# Altium project ExtruderZProbe.PrjPcb
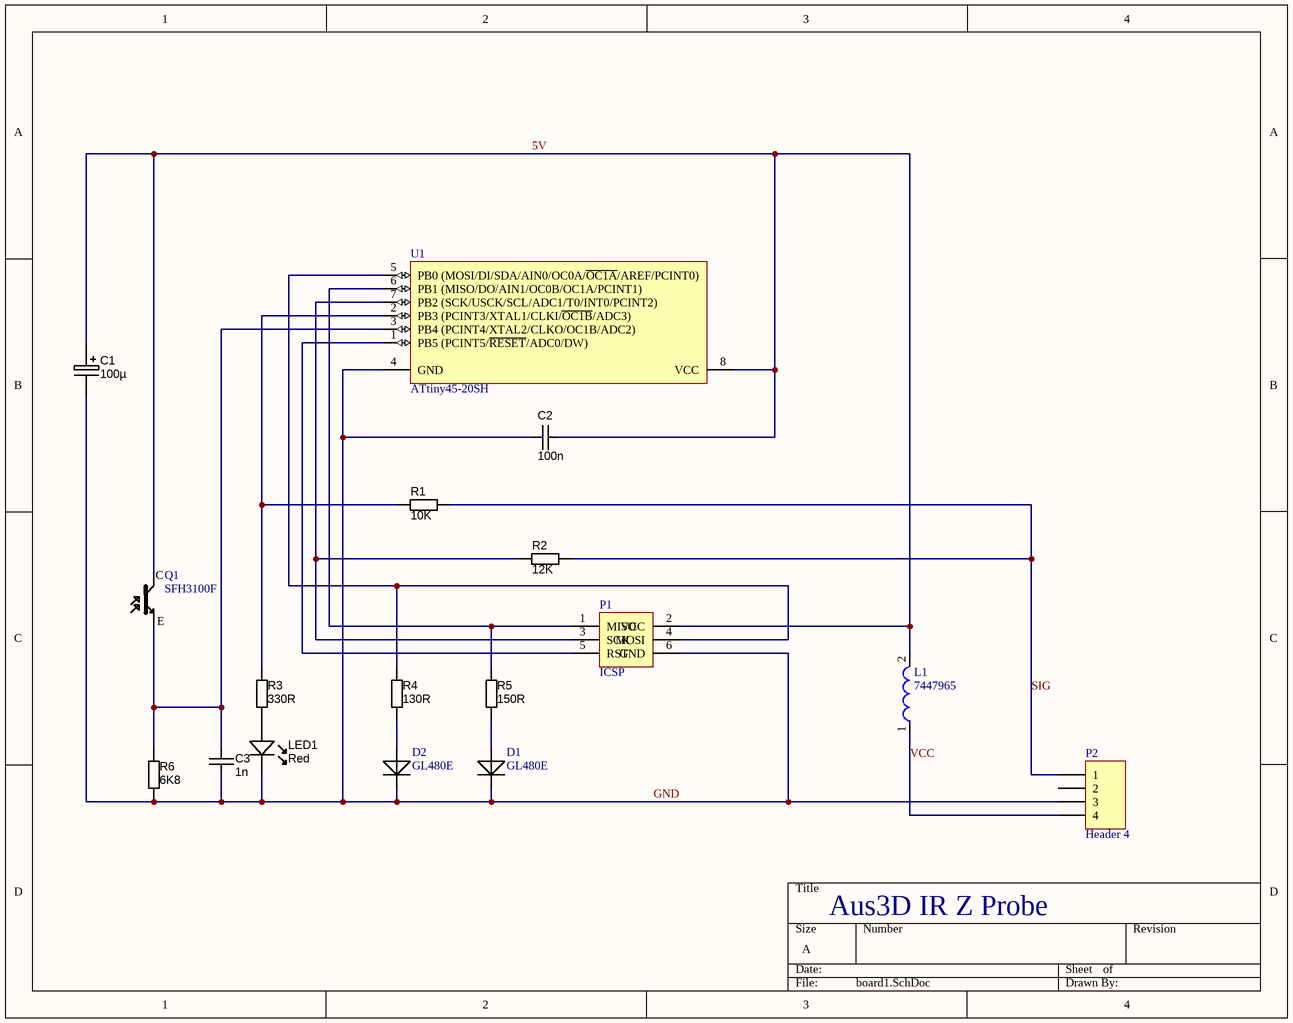
[diagram p0: board1.SchDoc]
1 sheet, 17 parts. Net scope: global (net labels, ports and power ports of the same name join across sheets).
Board files: PCB4.PcbDoc, PCB3.PcbDoc

## Sheet board1.SchDoc
size A

### Parts
C1  100µ  [6.3-DIA-CAP]
C2  100n  [CAPC1005X55N]
C3  1n  [CAPC1005X55N]
D1  GL480E  [LED-2.54spacing]
D2  GL480E  [LED-2.54spacing]
L1  7447965  [SMD-0603]
LED1  Red  [LED-0603-RED]
P1  ICSP  [HDR2X3]
P2  Header 4  [JST-4P]
Q1  SFH3100F  [SFH3100F-footprint]
R1  value 10K  [RESC1608X55N]  (hidden comment: Thick Film)
R2  value 12K  [RESC1608X55N]  (hidden comment: Thick Film)
R3  value 330R  [RESC1608X55N]  (hidden comment: Thick Film)
R4  value 130R  [RESC1608X55N]  (hidden comment: Thick Film)
R5  value 150R  [RESC1608X55N]  (hidden comment: Thick Film)
R6  value 6K8  [RESC1608X55N]  (hidden comment: Thick Film)
U1  ATtiny45-20SH  [8S2_N]

### Nets
5V: C1.1 C2.2 L1.2 P1.2(VCC) Q1.1 U1.8(VCC)
GND: C1.2 C2.1 C3.2 D1.1 D2.1 LED1.K P1.6(GND) P2.3 R6.1 U1.4(GND)
SIG: P2.1 R1.1 R2.1
VCC: L1.1 P2.4
NetC3_1: C3.1 Q1.2 R6.2 U1.3(PB4_(PCINT4/XTAL2/CLKO/OC1B/ADC2))
NetD1_2: D1.2 R5.1
NetD2_2: D2.2 R4.1
NetLED1_A: LED1.A R3.2
NetP1_1: P1.1(MISO) R5.2 U1.6(PB1_(MISO/DO/AIN1/OC0B/OC1A/PCINT1))
NetP1_3: P1.3(SCK) R2.2 U1.7(PB2_(SCK/USCK/SCL/ADC1/T0/INT0/PCINT2))
NetP1_4: P1.4(MOSI) R4.2 U1.5(PB0_(MOSI/DI/SDA/AIN0/OC0A/~{OC1A}/AREF/PCINT0))
NetP1_5: P1.5(RST) U1.1(PB5_(PCINT5/~{RESET}/ADC0/DW))
NetR1_2: R1.2 R3.1 U1.2(PB3_(PCINT3/XTAL1/CLKI/~{OC1B}/ADC3))

Not connected (* = marked no-connect by the designer): P2 2

### Notes on the sheet
- Aus3D IR Z Probe
- (in symbol SFH3100F) C; E

### Library data of the parts
C1 = CAPE_100u_16V_THD: Capacitor THD Electrolytic 100uF 20% 16V Radial; Manufacturer: Panasonic - ECG; Manufacturer Part Number: ECA-1CM101; Material: Aluminum Electrolytic; SCDType: spec; Package / Case: Radial - Through hole; Ratings: 16V; Tolerance: ±20%; Supplier 1: Digi-Key; Supplier Part Number 1: P5138-ND; Value: 100µ; Supplier: http://au.rs-online.com/web/p/aluminium-capacitors/4490968/
C2 = CAPC_100n_0402_X5R_16V_10%: Capacitor SMD Cer 100nF 10% 16V X5R 0402; Manufacturer 1: AVX Corporation; Manufacturer Part Number 1: 0402YD104KAT2A; Ratings: 16V; X5R; SCDType: spec; Tolerance: ±10%; Operating Temperature: -55°C ~ 125°C; Package / Case: 0402 (1005 Metric); Size / Dimension: 0.039" L x 0.020" W (1.00mm x 0.50mm); Supplier 1: Digi-Key; Supplier Part Number 1: 478-1126-1-ND; ComponentLink1URL: http://www.avx.com/docs/Catalogs/cx5r.pdf; ComponentLink1Description: http://www.avx.com/docs/Catalogs/cx5r.pdf; Supplier 2: Digi-Key; Supplier Part Number 2: 311-1347-1-ND; Manufacturer 2: Yageo; Manufacturer Part Number 2: CC0402KRX5R7BB104; ComponentLink2URL: http://www.yageo.com/documents/recent/UPY-GPHC_X5R_4V-to-50V_12.pdf; ComponentLink2Description: http://www.yageo.com/documents/recent/UPY-GPHC_X5R_4V-to-50V_12.pdf; Value: 100n; Supplier: http://au.rs-online.com/web/p/ceramic-multilayer-capacitors/6983197/
C3 = CAPC_1n_0402_X7R_16V_10%: Capacitor SMD Cer 1nF 10% 16V X7R 0402; Manufacturer 1: AVX Corporation; Manufacturer Part Number 1: 0402YC102KAT2A; Ratings: 16V; X7R; SCDType: spec; Tolerance: ±10%; Operating Temperature: -55°C ~ 125°C; Package / Case: 0402 (1005 Metric); Size / Dimension: 0.039" L x 0.020" W (1.00mm x 0.50mm); Manufacturer 2: Yageo; Manufacturer Part Number 2: CC0402KRX7R7BB102; Supplier 1: Digi-Key; Supplier Part Number 1: 478-6197-1-ND; ComponentLink1URL: http://www.avx.com/docs/Catalogs/cx7r.pdf; ComponentLink1Description: http://www.avx.com/docs/Catalogs/cx7r.pdf; Supplier 2: Digi-Key; Supplier Part Number 2: 311-1352-1-ND; ComponentLink2URL: http://www.yageo.com/documents/recent/UPY-GPHC_X7R_6.3V-to-50V_8.pdf; ComponentLink2Description: http://www.yageo.com/documents/recent/UPY-GPHC_X7R_6.3V-to-50V_8.pdf; Value: 1n; Supplier: http://au.rs-online.com/web/p/ceramic-multilayer-capacitors/6983178/
L1 = 7447965: SMD-Multilayer Inductor WE-MI, L = 1.00 µH; Inductance: 1.00 µH; DatasheetVersion: ver 5, Oct-2004; PackageVersion: 2009; PackageReference: SMD-0603; PackageDescription: Chip Inductor, 2-Leads, Body 1.6 x 0.8 mm; ComponentLink1Description: Manufacturer URL; ComponentLink1URL: http://www.we-online.com; ComponentLink2Description: Datasheet; ComponentLink2URL: http://www.we-online.de/katalog/media/pdf/7447965.pdf; Supplier: https://au.rs-online.com/web/p/multilayer-surface-mount-inductors/6041473/
LED1 = LED_SMD_Red_0603_220mcd: LED 0603 SMD Hyper Red 630nm 220mcd 20mA; Manufacturer 1: Kingbright Company LLC; Manufacturer Part Number 1: APT1608SURCK; Material: AlGaInP on GaAs; Ratings: 220 mcd; 630 nm; Voltage - Forward (Vf) Typ: 1.95V; Voltage - Forward (Vf) @ 10mA: 1.9V; SCDType: source; Package / Case: 0603 (1608 metric); Supplier 1: Digi-Key; Supplier Part Number 1: 754-1123-1-ND; ComponentLink1URL: http://www.us.kingbright.com/images/catalog/SPEC/APT1608SURCK.pdf; ComponentLink1Description: http://www.us.kingbright.com/images/catalog/SPEC/APT1608SURCK.pdf
P1 = Header 3X2: Header, 3-Pin, Dual row; LatestRevisionDate: 17-Jul-2002; LatestRevisionNote: Re-released for DXP Platform.; Publisher: Altium Limited
P2 = Header 4: Header, 4-Pin; LatestRevisionDate: 17-Jul-2002; LatestRevisionNote: Re-released for DXP Platform.; Publisher: Altium Limited; Supplier: http://au.rs-online.com/web/p/pcb-headers/8201551/
Q1 = SFH3100F: GL480E; Supplier: http://au.rs-online.com/web/p/phototransistors/6548738/
R1 R2 R4-R6 = RES_2K2_0603_5%: Resistor SMD chip 2.2k Ohm 0.1W 5% 0603; Manufacturer 1: Yageo; Manufacturer Part Number 1: RC0603JR-072K2L; Ratings: 1/10 W; SCDType: spec; Temperature Coefficient: ±100ppm/°C; Package / Case: 0603 (1608 metric); Tolerance: ±5%; Material: Thick Film; Supplier 1: Digi-Key; Supplier Part Number 1: 311-2.2KGRDKR-ND; RoHS 1: RoHS Compliant; ComponentLink1URL: http://www.yageo.com/documents/recent/PYu-RC0603_51_RoHS_L_4.pdf; ComponentLink1Description: http://www.yageo.com/documents/recent/PYu-RC0603_51_RoHS_L_4.pdf; Supplier 2: Digi-Key; Supplier Part Number 2: 1276-5070-6-ND; Manufacturer 2: Samsung Electro-Mechanics America, Inc; Manufacturer Part Number 2: RC1608J222CS; RoHS 2: RoHS Compliant; ComponentLink2URL: http://www.samsungsem.com/servlet/FileDownload?filename=productcatalog/pdf/Chip_Resistor.pdf; ComponentLink2Description: http://www.samsungsem.com/servlet/FileDownload?filename=productcatalog/pdf/Chip_Resistor.pdf; Supplier 3: Digi-Key; Supplier Part Number 3: RMCF0603JT2K20DKR-ND; Manufacturer 3: Stackpole Electronics Inc; Manufacturer Part Number 3: RMCF0603JT2K20; RoHS 3: RoHS Compliant; ComponentLink3URL: http://www.seielect.com/Catalog/SEI-RMCF_RMCP.pdf; ComponentLink3Description: http://www.seielect.com/Catalog/SEI-RMCF_RMCP.pdf; Supplier 4: Digi-Key; Supplier Part Number 4: RHM2.2KCGDKR-ND; Manufacturer 4: Rohm Semiconductor; Manufacturer Part Number 4: MCR03ERTJ222; RoHS 4: RoHS Compliant; ComponentLink4URL: http://rohmfs.rohm.com/en/products/databook/datasheet/passive/resistor/chip_resistor/mcr_g.pdf; ComponentLink4Description: http://rohmfs.rohm.com/en/products/databook/datasheet/passive/resistor/chip_resistor/mcr_g.pdf; Supplier 5: Digi-Key; Supplier Part Number 5: P2.2KGDKR-ND; Manufacturer 5: Panasonic Electronic Components; Manufacturer Part Number 5: ERJ-3GEYJ222V; RoHS 5: RoHS Compliant; ComponentLink5URL: http://industrial.panasonic.com/www-cgi/jvcr13pz.cgi?E+PZ+3+AOA0001+ERJ3GEYJ222V+7+WW; ComponentLink5Description: http://industrial.panasonic.com/www-cgi/jvcr13pz.cgi?E+PZ+3+AOA0001+ERJ3GEYJ222V+7+WW
  R1: Supplier: http://au.rs-online.com/web/p/surface-mount-fixed-resistors/6789667/
  R2: Supplier: http://au.rs-online.com/web/p/surface-mount-fixed-resistors/7088745/
  R4: Supplier: http://au.rs-online.com/web/p/surface-mount-fixed-resistors/8102129/
  R5: Supplier: http://au.rs-online.com/web/p/surface-mount-fixed-resistors/6789784/
  R6: Supplier: http://au.rs-online.com/web/p/surface-mount-fixed-resistors/8102303/
R3 = RES_330R_0603_5%: Resistor SMD chip 330 Ohm 0.1W 5% 0603; Manufacturer 1: Vishay Dale; Manufacturer Part Number 1: CRCW0603330RJNEA; Ratings: 1/10 W; SCDType: spec; Manufacturer 2: Yageo; Manufacturer Part Number 2: RC0603JR-07330RL; Package / Case: 0603 (1608 metric); Tolerance: ±5%; Material: Thick Film; Supplier 1: Digi-Key; Supplier Part Number 1: 541-330GCT-ND; ComponentLink1URL: http://www.vishay.com/doc?20035; ComponentLink1Description: http://www.vishay.com/doc?20035; Supplier 2: Digi-Key; Supplier Part Number 2: 311-330GRCT-ND; ComponentLink2URL: http://www.yageo.com/documents/recent/PYu-RC0603_51_RoHS_L_4.pdf; ComponentLink2Description: http://www.yageo.com/documents/recent/PYu-RC0603_51_RoHS_L_4.pdf; Supplier: http://au.rs-online.com/web/p/surface-mount-fixed-resistors/6790226/
U1 = ATtiny45-20SH: 8-bit AVR Microcontroller, 20MHz, 2.7-5.5V, 4K Flash, 256 Bytes EEPROM, 256 Bytes SRAM, Industrial Grade (-40°C to 85°C), 8-Lead SOIC, Pb-Free; DatasheetVersion: revN, Apr-2011; PackageVersion: revF, Apr-2008; PackageReference: 8S2; PackageDescription: 8-Lead, 0.208" Body, Plastic Small Outline Package (EIAJ); ComponentLink1Description: Manufacturer URL; ComponentLink1URL: http://www.atmel.com/; ComponentLink2Description: ATtiny25/45/85 Datasheet; ComponentLink2URL: http://www.atmel.com/dyn/resources/prod_documents/doc2586.pdf; ComponentLink3Description: ATtiny25/45/85 Summary; ComponentLink3URL: http://www.atmel.com/dyn/resources/prod_documents/2586S.pdf
D1 D2 = GL480E
  D2: Supplier: http://au.rs-online.com/web/p/ir-leds/0577538/